# EAGLE design SPinner (EAGLE 9.4.2)
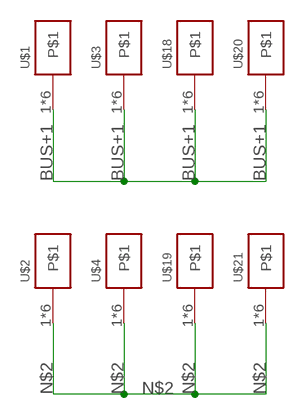
[diagram p0: schematic, sheet 1]

## Parts
U$1  KCONNECT  [KCONNECT]
U$2  KCONNECT  [KCONNECT]
U$3  KCONNECT  [KCONNECT]
U$4  KCONNECT  [KCONNECT]
U$18  KCONNECT  [KCONNECT]
U$19  KCONNECT  [KCONNECT]
U$20  KCONNECT  [KCONNECT]
U$21  KCONNECT  [KCONNECT]

## Nets
BUS+1: U$1.1 U$1.2 U$1.3 U$1.4 U$1.P$1 U$1.P$2 U$3.1 U$3.2 U$3.3 U$3.4 U$3.P$1 U$3.P$2 U$18.1 U$18.2 U$18.3 U$18.4 U$18.P$1 U$18.P$2 U$20.1 U$20.2 U$20.3 U$20.4 U$20.P$1 U$20.P$2
N$2: U$2.1 U$2.2 U$2.3 U$2.4 U$2.P$1 U$2.P$2 U$4.1 U$4.2 U$4.3 U$4.4 U$4.P$1 U$4.P$2 U$19.1 U$19.2 U$19.3 U$19.4 U$19.P$1 U$19.P$2 U$21.1 U$21.2 U$21.3 U$21.4 U$21.P$1 U$21.P$2

## Library data of the parts
U$1-U$4 U$18-U$21 = CanCubeSat:KCONNECT

## Board
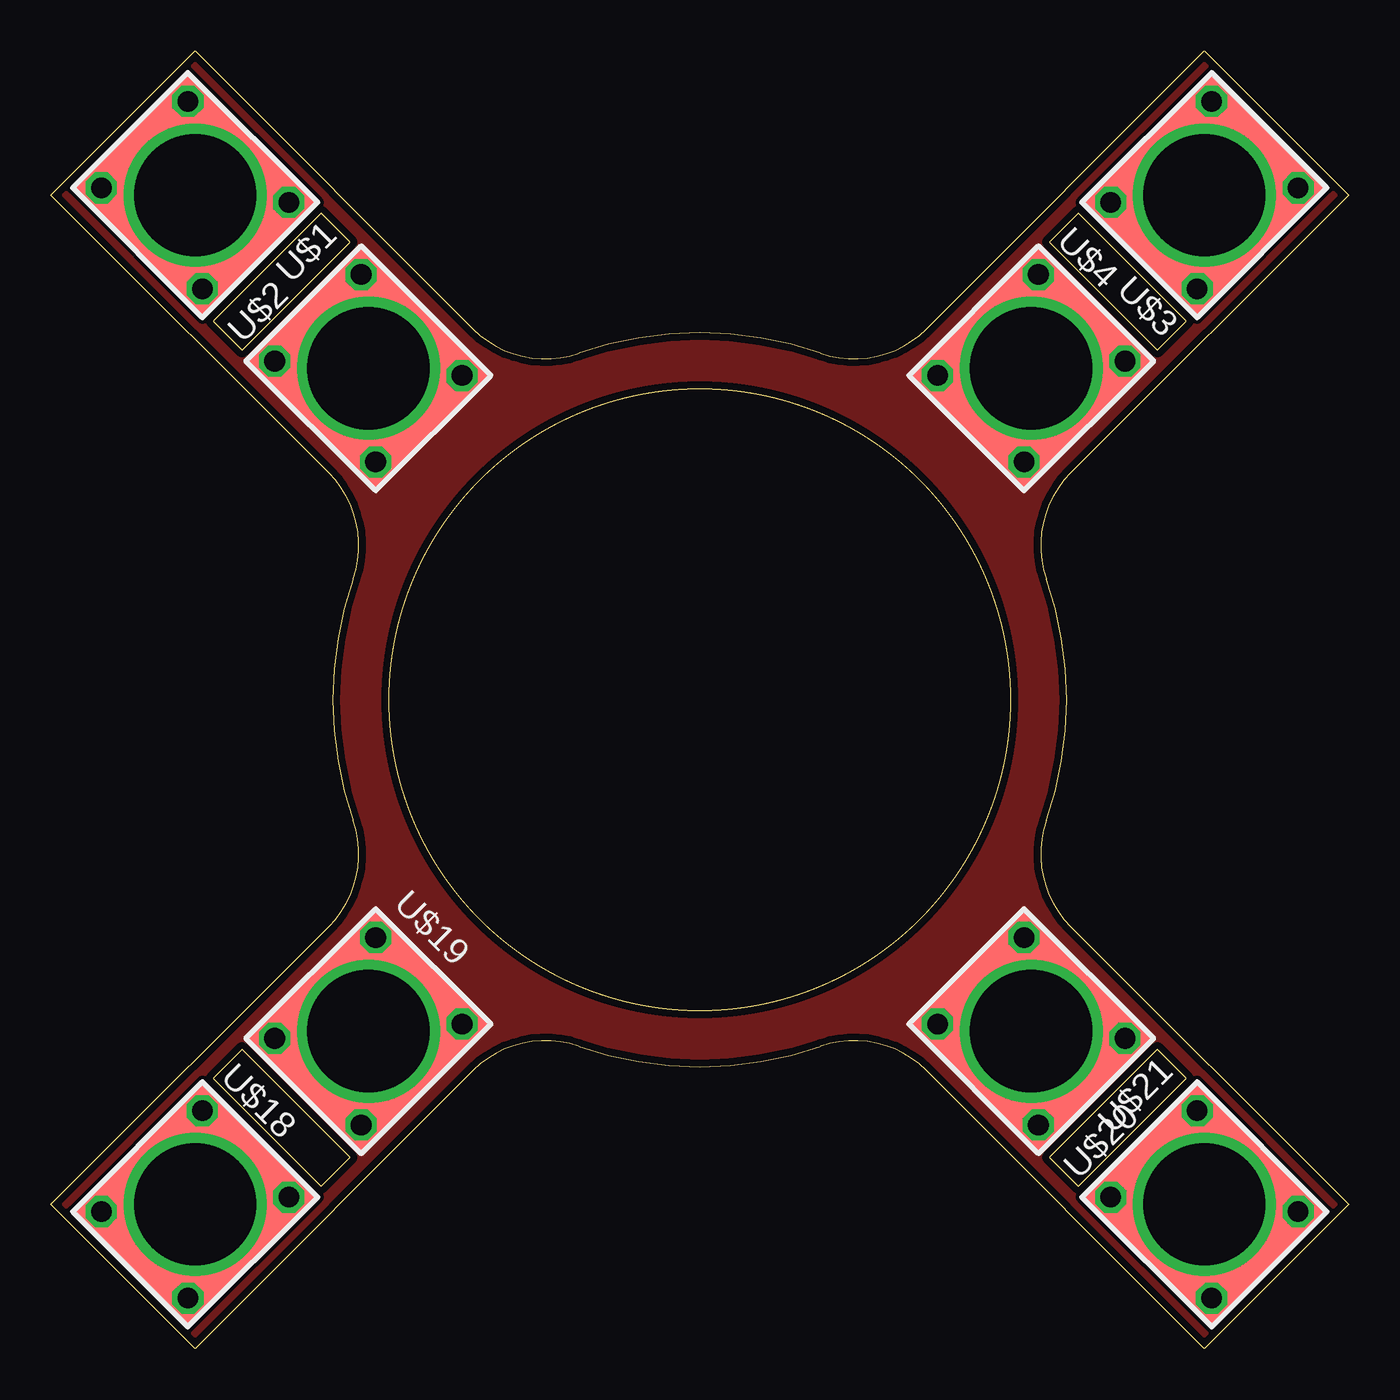
[diagram p1: board, top side]
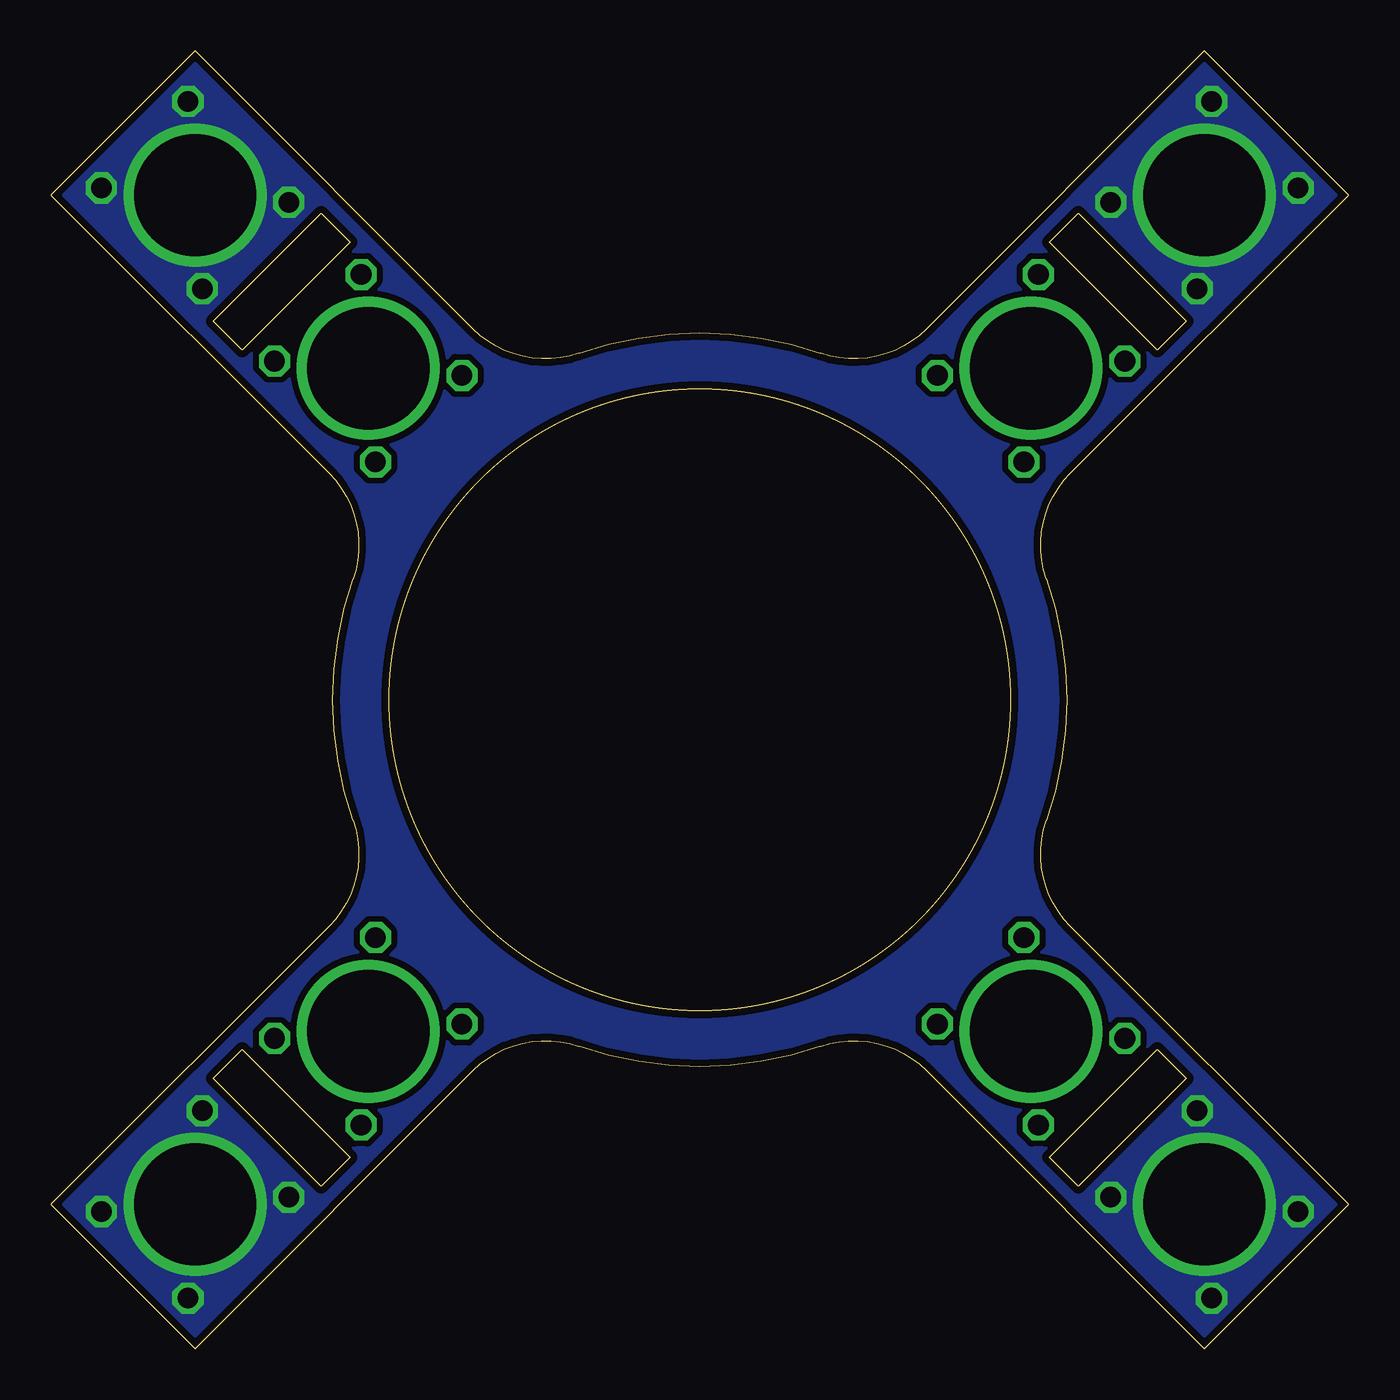
[diagram p2: board, bottom side, seen from below]

Size 63.64 x 63.64 mm. Coordinates in mm from the lower left corner, seen from the top.
Outline: 0,56.57 7.07,63.64 20.71,50 arc64 25.89,48.82 arc-38 37.75,48.82 arc64 42.93,50 56.57,63.64 63.64,56.57 50,42.93 arc64 48.82,37.75 arc-38 48.82,25.89 arc64 50,20.71 63.64,7.07 56.57,0 42.93,13.64 arc64 37.75,14.82 arc-38 25.89,14.82 arc64 20.71,13.64 7.07,0 0,7.07 13.64,20.71 arc64 14.82,25.89 arc-38 14.82,37.75 arc64 13.64,42.93 0,56.57
Outline: 13.26,55.69 7.96,50.38 9.37,48.97 14.67,54.27 13.26,55.69
Outline: 7.96,13.26 13.26,7.96 14.67,9.37 9.37,14.67 7.96,13.26
Outline: 50.38,55.69 48.97,54.27 54.27,48.97 55.69,50.38 50.38,55.69
Outline: 48.97,9.37 50.38,7.96 55.69,13.26 54.27,14.67 48.97,9.37
Outline: circle at 31.82,31.82 radius 15.25
Copper layers (1*16): Top 0.035mm / dielectric 1.5mm / Bottom 0.035mm
Design rules "default *": minimum track width 0.3mm, minimum drill 0.35mm, track to track 0.2mm, track to pad 0.2mm, pad to pad 0.2mm, via to via 0.2mm, smd to smd 0.2mm, copper to edge 0.35mm, drill to drill 6mil, minimum pad ring 10mil, minimum via ring 8mil, stop-mask expansion 2mil, vias tented up to drill 0mil, thermal gap 10mil

### Footprints (pad centres in the part's own frame; a part is rotated, then mirrored left to right if it is on the bottom)
KCONNECT = drill 1.016 octagon: 1 -3,-3.5; 2 -3,3.5; 3 3,-3.5; 4 3,3.5 | drill 6: P$1 0,0 | smd 8 x 9: P$2 0,0

### Placement (x,y rotation side)
U$1  7.07,56.57 225 top
U$2  15.57,48.08 45 top
U$3  56.57,56.57 135 top
U$4  48.08,48.08 315 top
U$18  7.07,7.07 315 top
U$19  15.57,15.56 315 top
U$20  56.57,7.07 45 top
U$21  48.08,15.56 225 top

### Tracks (layer width: path | path; a pad name or v marks a point on that pad's centre or on a via)
BUS+1
  Top 0.3: 6.82,6.82 6.82,2.57 U$18.3 | 6.82,6.82 2.57,6.82 U$18.1 | 6.82,6.82 U$18.P$2 | 7.57,7.32 7.32,7.32 U$18.P$2 | 7.57,7.32 11.57,7.32 U$18.4 | 7.57,7.32 7.57,11.57 U$18.2 | 7.57,7.32 U$18.P$2 | 6.82,56.82 2.57,56.82 U$1.3 | 56.32,7.32 52.07,7.32 U$20.2 | 56.82,6.82 56.82,2.57 U$20.1 | 7.32,56.32 7.32,52.07 U$1.4 | 56.82,6.82 61.07,6.82 U$20.3 | 56.82,6.82 U$20.P$2 56.32,7.32 | 56.32,7.32 56.32,11.57 U$20.4 | 7.32,56.32 11.57,56.32 U$1.2 | 7.32,56.32 U$1.P$2 6.82,56.82 | 6.82,56.82 6.82,61.07 U$1.1 | 56.07,56.32 52.07,56.32 U$3.4 | 56.07,56.32 56.32,56.57 56.57,56.32 56.82,56.57 U$3.P$2 | 56.07,56.32 56.07,52.07 U$3.2 | 56.07,56.32 U$3.P$2 | 59.07,59.07 57.07,61.07 U$3.3 | 59.07,59.07 61.07,57.07 U$3.1 | 59.07,59.07 U$3.P$2
  pour Bottom (isolate 0.3, no thermals): -9.68,68.1 -9.68,-2.61 75.17,-2.61 75.17,68.1
N$2
  pour Top (isolate 0.3, no thermals): -9.68,68.1 -9.68,-2.61 75.17,-2.61 75.17,68.1